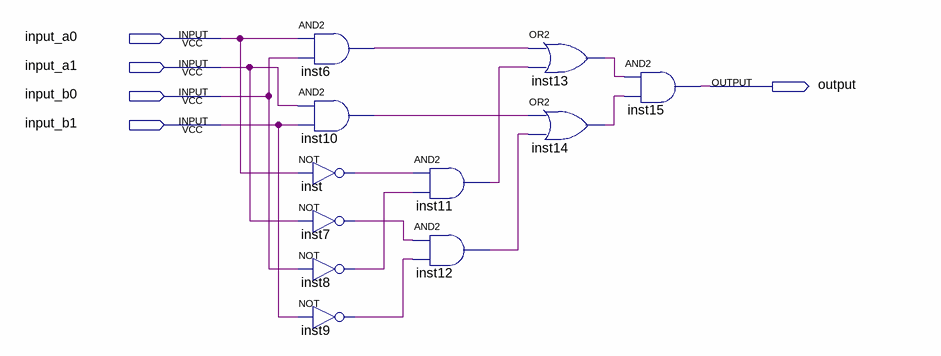
[diagram p0: schematic sheet]
// Quartus schematic 2bit_comparator.bdf as structural Verilog: 11 symbols, 5 pins
module \2bit_comparator  (
  input  input_a0,
  input  input_a1,
  input  input_b0,
  input  input_b1,
  output \output 
);

  wire inst6_out, inst7_out, inst8_out, inst9_out, inst10_out, inst11_out, inst12_out, inst13_out,
       inst14_out, inst_out;

  and inst6 (inst6_out, input_a0, input_b0);
  and inst10 (inst10_out, input_a1, input_b1);
  not inst (inst_out, input_a0);
  not inst7 (inst7_out, input_a1);
  not inst8 (inst8_out, input_b0);
  not inst9 (inst9_out, input_b1);
  and inst11 (inst11_out, inst_out, inst8_out);
  and inst12 (inst12_out, inst7_out, inst9_out);
  or inst13 (inst13_out, inst6_out, inst11_out);
  or inst14 (inst14_out, inst10_out, inst12_out);
  and inst15 (\output , inst13_out, inst14_out);
endmodule
